# EasyEDA Pro project 304-Quad-Channel-Voltage-Controlled-Mixer.eprj

# Board PCB1
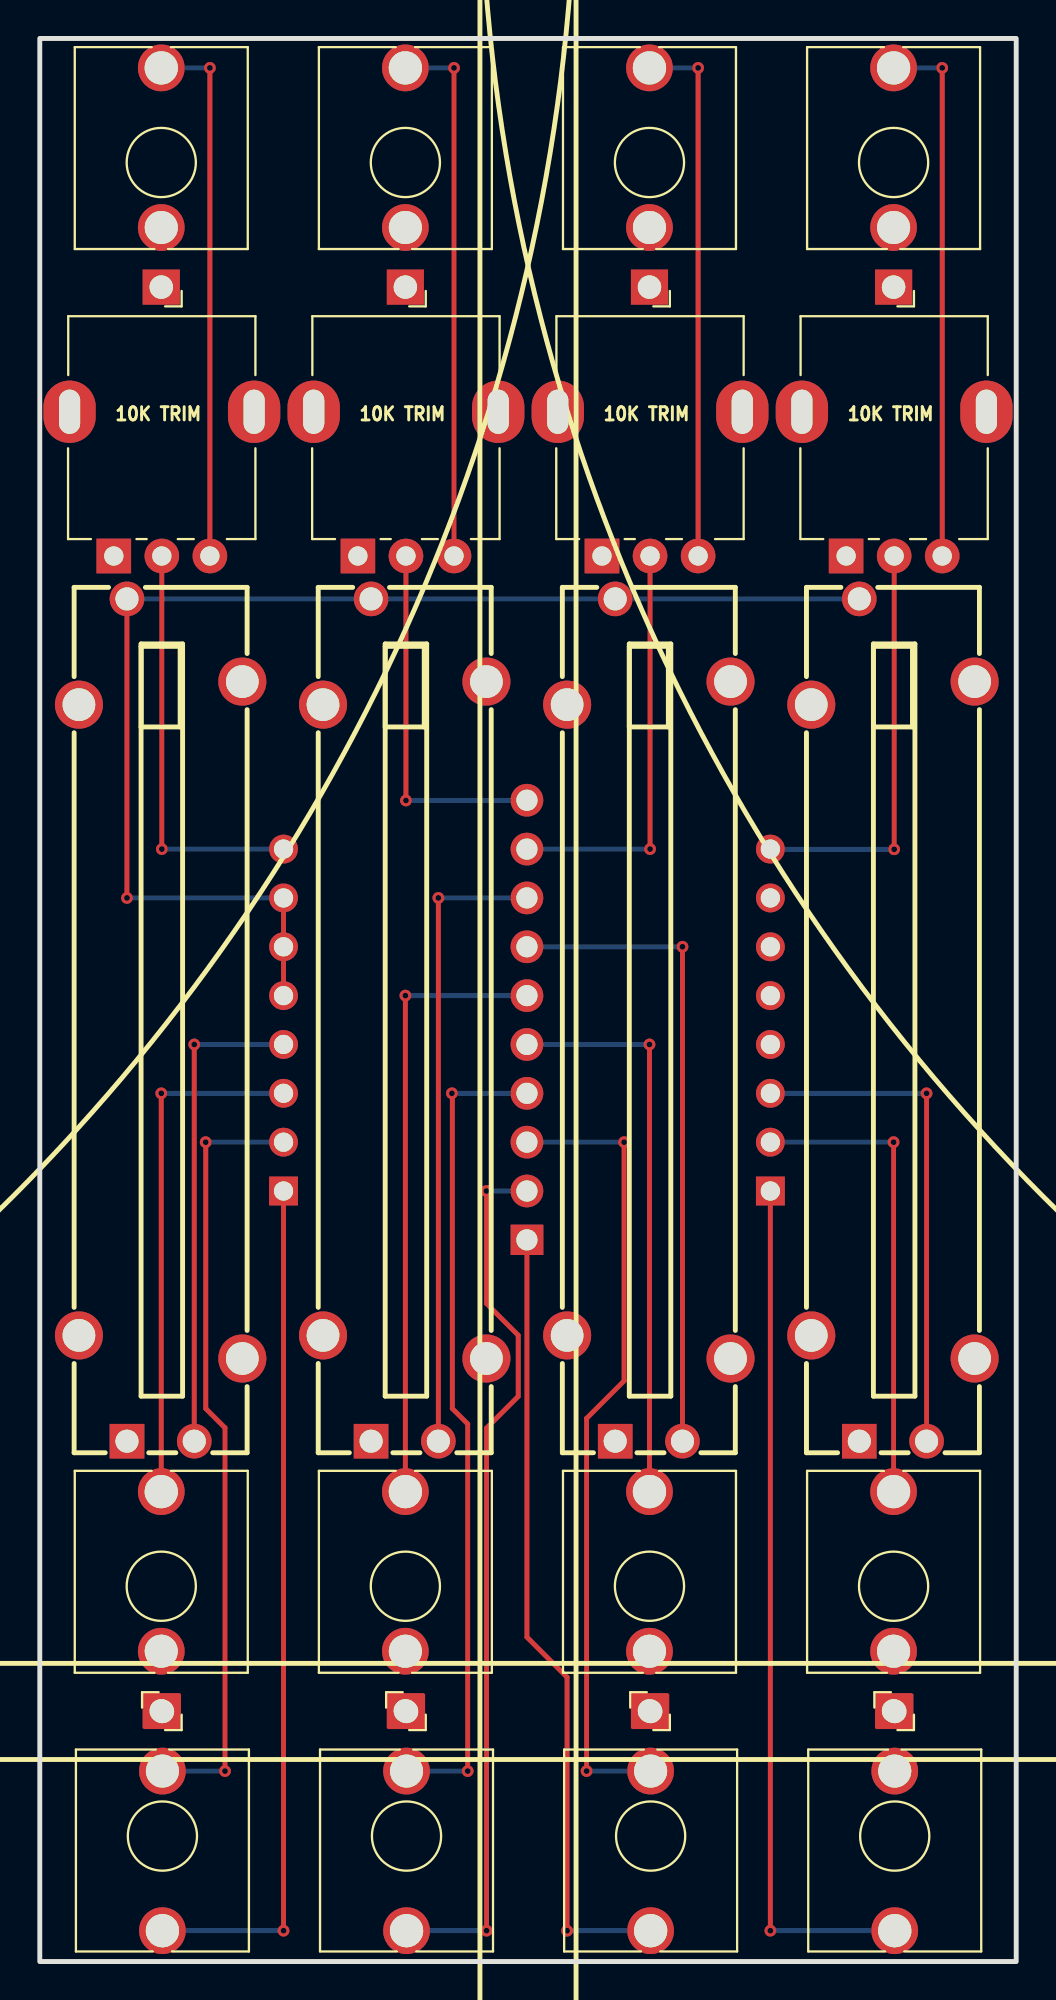
[diagram p0: board, top side]
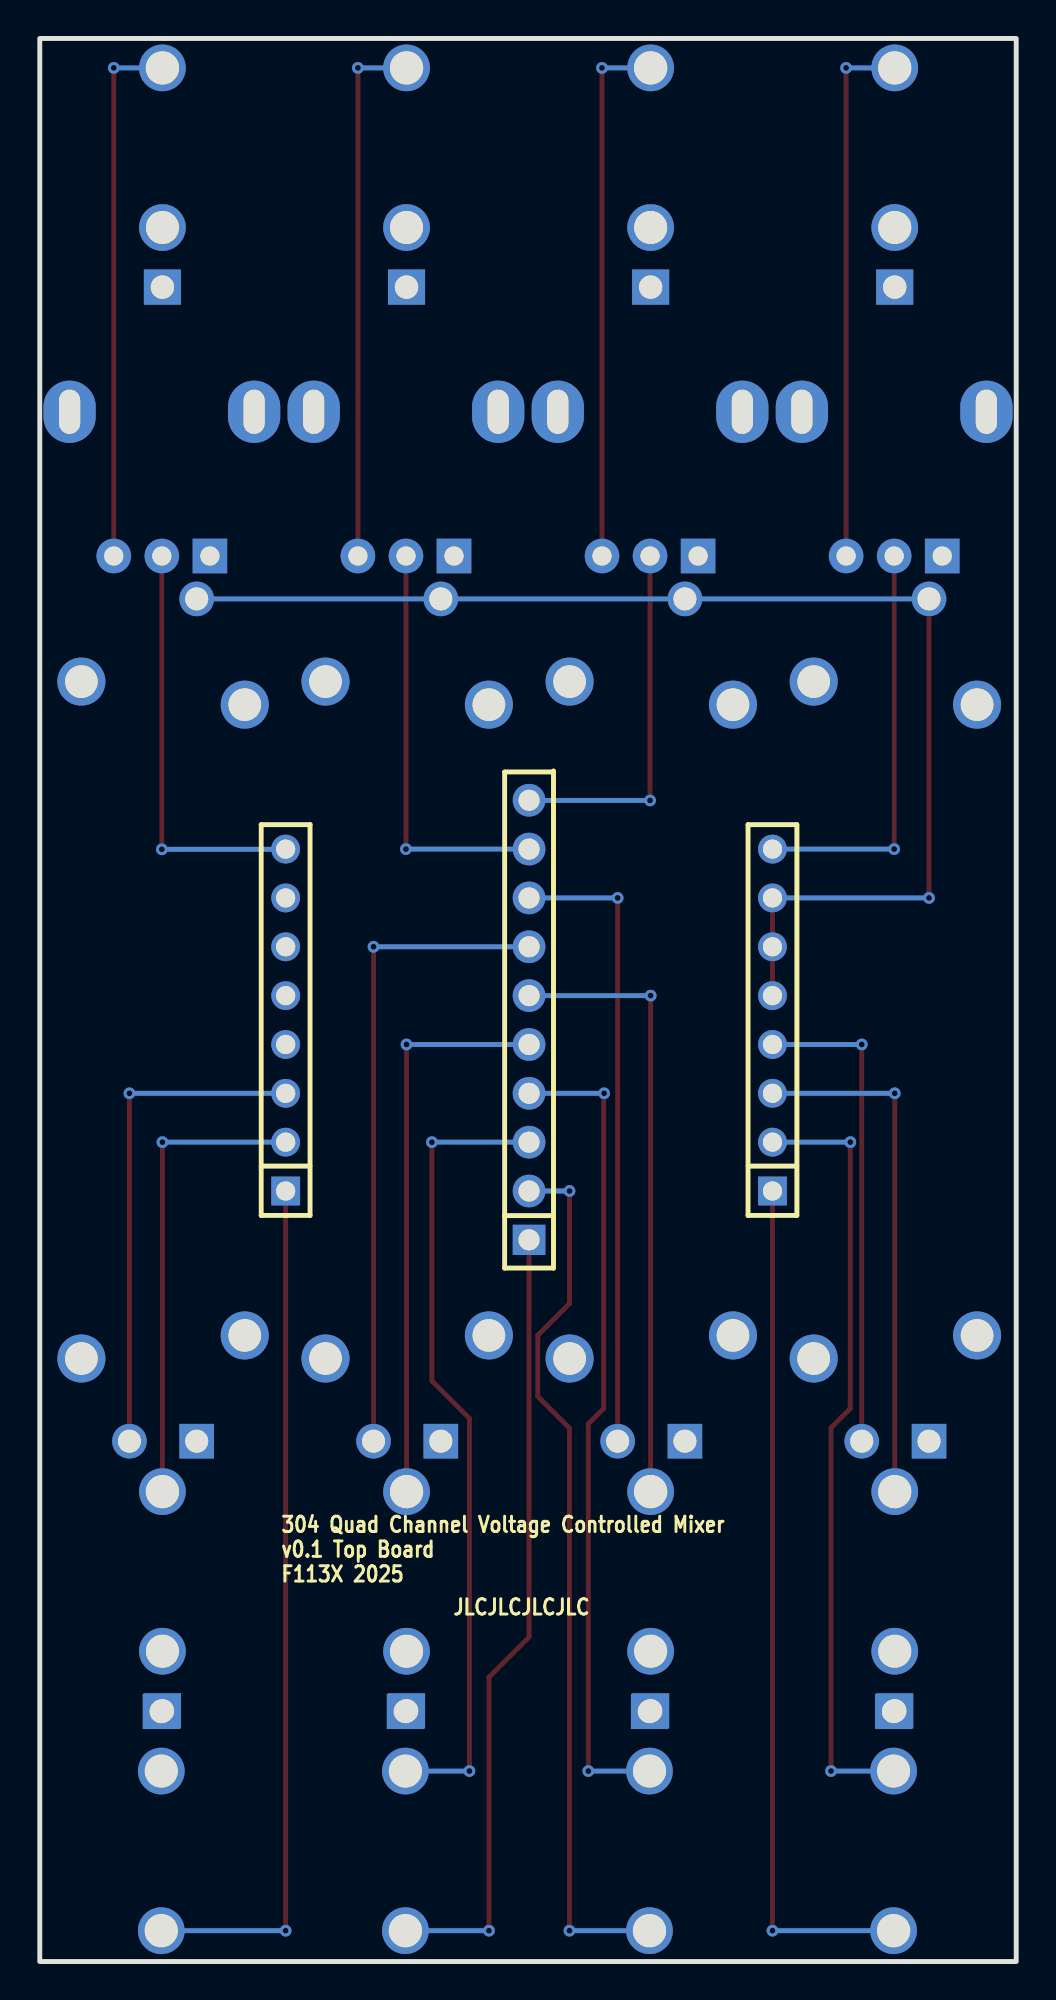
[diagram p1: board, bottom side, seen from below]

Outline 50.8 x 100 mm; copper layers: Top Layer, Bottom Layer. Coordinates in mm from the lower left corner of the outline.
Outline path: rectangle 0,100 50.8,0
Stack: Top Layer 0.035mm / Dielectric1 1.51mm FR4 er 4.5 / Bottom Layer 0.035mm

## Design rules (mm)
template: JLCPCB Capability(Two Layers Board)
spacing copperThickness1oz (default): track to track 0.102, other pairs 0.152 to 0.3
spacing copperThickness2oz: track to track 0.203, other pairs 0.152 to 0.3
track width copperThickness1oz (default): min 0.127, default 0.254, max 2.54
track width copperThickness2oz: min 0.203, default 0.254, max 2.54
differential pair differentialPair (default): width min 0.127, default 0.254, max 2.54; gap min 0.152, default 0.152
via viaSize (default): diameter min 0.5, default 0.61, max 10; hole min 0.3, default 0.305, max 6.3

## Placement (name value [footprint] x y rotation side)
10K TRIM  -  [benjiaomodular:Potentiometer_RV09]  3.85 73.09 90 top
10K TRIM#2  -  [benjiaomodular:Potentiometer_RV09]  16.55 73.09 90 top
10K TRIM#3  -  [benjiaomodular:Potentiometer_RV09]  29.25 73.09 90 top
10K TRIM#4  -  [benjiaomodular:Potentiometer_RV09]  41.95 73.09 90 top
H1  -  [HDR-TH_8P-P2.54-V-M]  12.68 48.96 90 bottom
H1#2  -  [HDR-TH_8P-P2.54-V-M]  38.01 48.96 90 bottom
H2  PZ254V-11-10P  [HDR-TH_10P-P2.54-V-M]  25.34 48.96 90 bottom
J1  -  [benjiaomodular:AudioJack_3.5mm]  6.32 13.04 180 top
J1#2  -  [benjiaomodular:AudioJack_3.5mm]  6.38 13 0 top
J1#3  -  [benjiaomodular:AudioJack_3.5mm]  6.32 87.07 180 top
J1#4  -  [benjiaomodular:AudioJack_3.5mm]  19.02 87.07 180 top
J1#5  -  [benjiaomodular:AudioJack_3.5mm]  31.72 87.07 180 top
J1#6  -  [benjiaomodular:AudioJack_3.5mm]  44.42 87.07 180 top
J1#7  -  [benjiaomodular:AudioJack_3.5mm]  31.78 13 0 top
J1#8  -  [benjiaomodular:AudioJack_3.5mm]  31.72 13.04 180 top
J1#9  -  [benjiaomodular:AudioJack_3.5mm]  44.48 13 0 top
J1#10  -  [benjiaomodular:AudioJack_3.5mm]  44.42 13.04 180 top
J1#11  -  [benjiaomodular:AudioJack_3.5mm]  19.02 13.04 180 top
J1#12  -  [benjiaomodular:AudioJack_3.5mm]  19.08 13 0 top
R1  -  [RES-ADJ-TH_L45.0-W9.0_C3051N-CE20B5.0-A103-0P0]  6.29 48.96 90 top
R1#2  -  [RES-ADJ-TH_L45.0-W9.0_C3051N-CE20B5.0-A103-0P0]  18.99 48.96 90 top
R1#3  -  [RES-ADJ-TH_L45.0-W9.0_C3051N-CE20B5.0-A103-0P0]  31.69 48.96 90 top
R1#4  -  [RES-ADJ-TH_L45.0-W9.0_C3051N-CE20B5.0-A103-0P0]  44.39 48.96 90 top

## Footprints (pads in the part's own frame, mm; a bottom-side part is the same pattern mirrored in y, then rotated)
benjiaomodular:AudioJack_3.5mm
  rect 1.93x1.83 hole 1.22: S(0,0)
  round 2.43 hole 1.73: T(0,-11.4)
  round 2.43 hole 1.72: TN(0,-3.1)
benjiaomodular:Potentiometer_RV09
  rect 1.8x1.8 hole 1: 1(0,0)
  round 1.8 hole 1: 2(0,-2.5) 3(0,-5)
  oval 3.24x2.72 hole 2.3x1.1: 4(7.5,-7.3) 5(7.5,2.3)
HDR-TH_8P-P2.54-V-M
  rect 1.5x1.5 hole 1: 1(-8.89,0)
  round 1.5 hole 1: 2(-6.35,0) 3(-3.81,0) 4(-1.27,0) 5(1.27,0) 6(3.81,0) 7(6.35,0) 8(8.89,0)
HDR-TH_10P-P2.54-V-M
  rect 1.575x1.7 hole 1.1: 1(-11.43,0)
  round 1.7 hole 1.1: 2(-8.89,0) 3(-6.35,0) 4(-3.81,0) 5(-1.27,0) 6(1.27,0) 7(3.81,0) 8(6.35,0) 9(8.89,0) 10(11.43,0)
RES-ADJ-TH_L45.0-W9.0_C3051N-CE20B5.0-A103-0P0
  rect 1.8x1.8 hole 1.2: 1(-21.9,1.75)
  round 1.8 hole 1.2: 2(-21.9,-1.75) 3(21.9,1.75)
  round 2.5 hole 1.7: 4(-16.4,4.25) 5(16.4,4.25) 6(17.6,-4.25) 7(-17.6,-4.25)

## Nets
GND: 10K TRIM.1 10K TRIM#2.1 10K TRIM#3.1 10K TRIM#4.1 H1#2.4 H1#2.5 H1#2.6 H1#2.7 J1.S J1#2.S J1#3.S J1#4.S J1#5.S J1#6.S J1#7.S J1#8.S J1#9.S J1#10.S J1#11.S J1#12.S R1.1 R1#2.1 R1#3.1 R1#4.1
+12: H1.5 H1.6 H1.7 R1.3 R1#2.3 R1#3.3 R1#4.3
CH1-CV: 10K TRIM.2 H1.8
CH1-IN: H1.3 J1.T
CH1-MIX: H1.2 J1#2.TN
CH1-OUT: H1.1 J1#2.T
CH2-CV: 10K TRIM#2.2 H2.10
CH2-IN: H2.6 J1#11.T
CH2-MIX: H2.4 J1#12.TN
CH2-OUT: H2.2 J1#12.T
CH3-CV: 10K TRIM#3.2 H2.9
CH3-IN: H2.5 J1#8.T
CH3-MIX: H2.3 J1#7.TN
CH3-OUT: H2.1 J1#7.T
CH4-CV: 10K TRIM#4.2 H1#2.8
CH4-IN: H1#2.2 J1#10.T
CH4/MIX-OUT: H1#2.1 J1#9.T
CHAN1-CV: 10K TRIM.3 J1#3.T
CHAN1-OFFSET: H1.4 R1.2
CHAN2-CV: 10K TRIM#2.3 J1#4.T
CHAN2-OFFSET: H2.8 R1#2.2
CHAN3-CV: 10K TRIM#3.3 J1#5.T
CHAN3-OFFSET: H2.7 R1#3.2
CHAN4-CV: 10K TRIM#4.3 J1#6.T
CHAN4-OFFSET: H1#2.3 R1#4.2

Pads without a net: 10K TRIM 4 5; 10K TRIM#2 4 5; 10K TRIM#3 4 5; 10K TRIM#4 4 5; J1 TN; J1#3 TN; J1#4 TN; J1#5 TN; J1#6 TN; J1#8 TN; J1#9 TN; J1#10 TN; J1#11 TN; R1 4 5 6 7; R1#2 4 5 6 7; R1#3 4 5 6 7; R1#4 4 5 6 7

## Via types
v1: diameter 0.61, hole 0.305, Top Layer to Bottom Layer, 28 vias

## Routing (per net, layer and track width the routed paths; a pad name or vN(x,y) marks a point on that pad's centre or on a via; arc(x,y) is an arc through that point)
+12: length 66.9
  Top Layer w0.254: H1.7 H1.6 H1.5 ; v1(4.54,55.31) R1.3
  Bottom Layer w0.254: v1(4.54,55.31) H1.7 ; R1.3 R1#2.3 R1#3.3 R1#4.3
CH1-CV: length 21.6
  Top Layer w0.254: v1(6.35,57.85) 10K TRIM.2
  Bottom Layer w0.254: v1(6.35,57.85) H1.8
CH1-IN: length 27.1
  Top Layer w0.254: J1.T v1(6.32,45.15)
  Bottom Layer w0.254: H1.3 v1(6.32,45.15)
CH1-MIX: length 40.4
  Top Layer w0.254: v1(8.63,42.61) 8.64,42.6 8.64,28.75 9.64,27.75 v1(9.64,9.9)
  Bottom Layer w0.254: H1.2 v1(8.63,42.61) ; J1#2.TN v1(9.64,9.9)
CH1-OUT: length 44.8
  Top Layer w0.254: v1(12.68,1.6) H1.1
  Bottom Layer w0.254: J1#2.T v1(12.68,1.6)
CH2-CV: length 19
  Top Layer w0.254: v1(19.05,60.38) 10K TRIM#2.2
  Bottom Layer w0.254: v1(19.05,60.38) 25.33,60.38 H2.10
CH2-IN: length 32.1
  Top Layer w0.254: J1#11.T v1(19.02,50.23)
  Bottom Layer w0.254: v1(19.02,50.23) H2.6
CH2-MIX: length 42.7
  Top Layer w0.254: v1(21.44,45.15) 21.46,45.12 21.46,28.75 22.26,27.95 v1(22.26,9.9)
  Bottom Layer w0.254: v1(21.44,45.15) H2.4 ; J1#12.TN v1(22.26,9.9)
CH2-OUT: length 46.1
  Top Layer w0.254: v1(23.24,1.6) 23.24,27.74 24.89,29.39 24.89,32.56 23.24,34.21 v1(23.24,40.07)
  Bottom Layer w0.254: J1#12.T v1(23.24,1.6) ; v1(23.24,40.07) H2.2
CH3-CV: length 21.6
  Top Layer w0.254: v1(31.75,57.85) 10K TRIM#3.2
  Bottom Layer w0.254: v1(31.75,57.85) H2.9
CH3-IN: length 29.6
  Top Layer w0.254: v1(31.72,47.69) J1#8.T
  Bottom Layer w0.254: H2.5 v1(31.72,47.69)
CH3-MIX: length 41.9
  Top Layer w0.254: v1(30.4,42.61) 30.4,30.2 28.45,28.25 v1(28.45,9.9)
  Bottom Layer w0.254: v1(28.45,9.9) J1#7.TN ; H2.3 v1(30.4,42.61)
CH3-OUT: length 41.1
  Top Layer w0.254: v1(27.43,1.6) 27.43,14.78 25.34,16.87 H2.1
  Bottom Layer w0.254: v1(27.43,1.6) J1#7.T
CH4-CV: length 21.7
  Top Layer w0.254: v1(44.45,57.84) 10K TRIM#4.2
  Bottom Layer w0.254: v1(44.45,57.84) 38.02,57.84 H1#2.8
CH4-IN: length 24.6
  Top Layer w0.254: J1#10.T v1(44.42,42.61)
  Bottom Layer w0.254: H1#2.2 v1(44.42,42.61)
CH4/MIX-OUT: length 44.9
  Top Layer w0.254: v1(38.01,1.6) H1#2.1
  Bottom Layer w0.254: v1(38.01,1.6) J1#9.T
CHAN1-CV: length 27.9
  Top Layer w0.254: v1(8.85,98.47) 10K TRIM.3
  Bottom Layer w0.254: J1#3.T v1(8.85,98.47)
CHAN1-OFFSET: length 25.3
  Top Layer w0.254: R1.2 v1(8.04,47.69)
  Bottom Layer w0.254: v1(8.04,47.69) H1.4
CHAN2-CV: length 27.9
  Top Layer w0.254: v1(21.55,98.47) 10K TRIM#2.3
  Bottom Layer w0.254: J1#4.T v1(21.55,98.47)
CHAN2-OFFSET: length 32.9
  Top Layer w0.254: v1(20.74,55.31) R1#2.2
  Bottom Layer w0.254: H2.8 v1(20.74,55.31)
CHAN3-CV: length 27.9
  Top Layer w0.254: v1(34.25,98.47) 10K TRIM#3.3
  Bottom Layer w0.254: J1#5.T v1(34.25,98.47)
CHAN3-OFFSET: length 33.8
  Top Layer w0.254: v1(33.44,52.77) R1#3.2
  Bottom Layer w0.254: v1(33.44,52.77) H2.7
CHAN4-CV: length 27.9
  Top Layer w0.254: v1(46.95,98.47) 10K TRIM#4.3
  Bottom Layer w0.254: v1(46.95,98.47) J1#6.T
CHAN4-OFFSET: length 26.2
  Top Layer w0.254: v1(46.14,45.15) R1#4.2
  Bottom Layer w0.254: v1(46.14,45.15) H1#2.3

## Copper pours and planes (outline as drawn; the poured copper is in the pictures)
GND on Top Layer: 0,100 50.8,100 50.8,0 0,0
GND on Bottom Layer: 0,100 50.8,100 50.8,0 0,0

## Text on the board
Bottom Silkscreen Layer: JLCJLCJLCJLC | 304 Quad Channel Voltage Controlled Mixer / v0.1 Top Board / F113X 2025

# Board PCB2
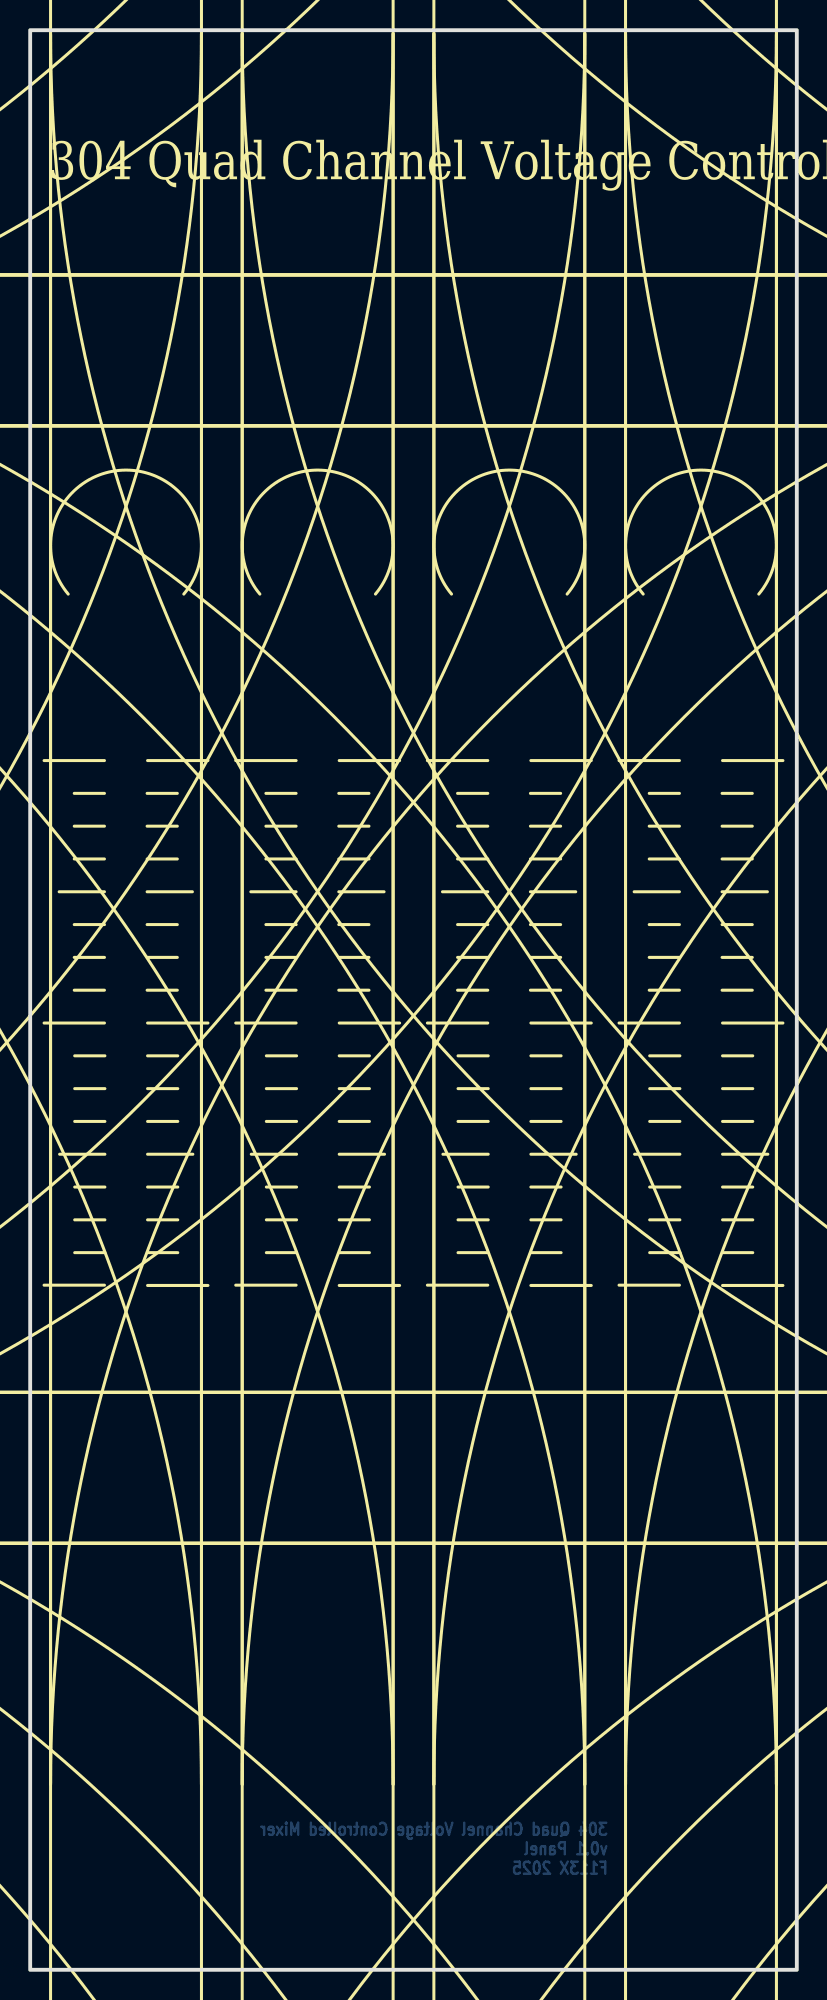
[diagram p2: board, top side]
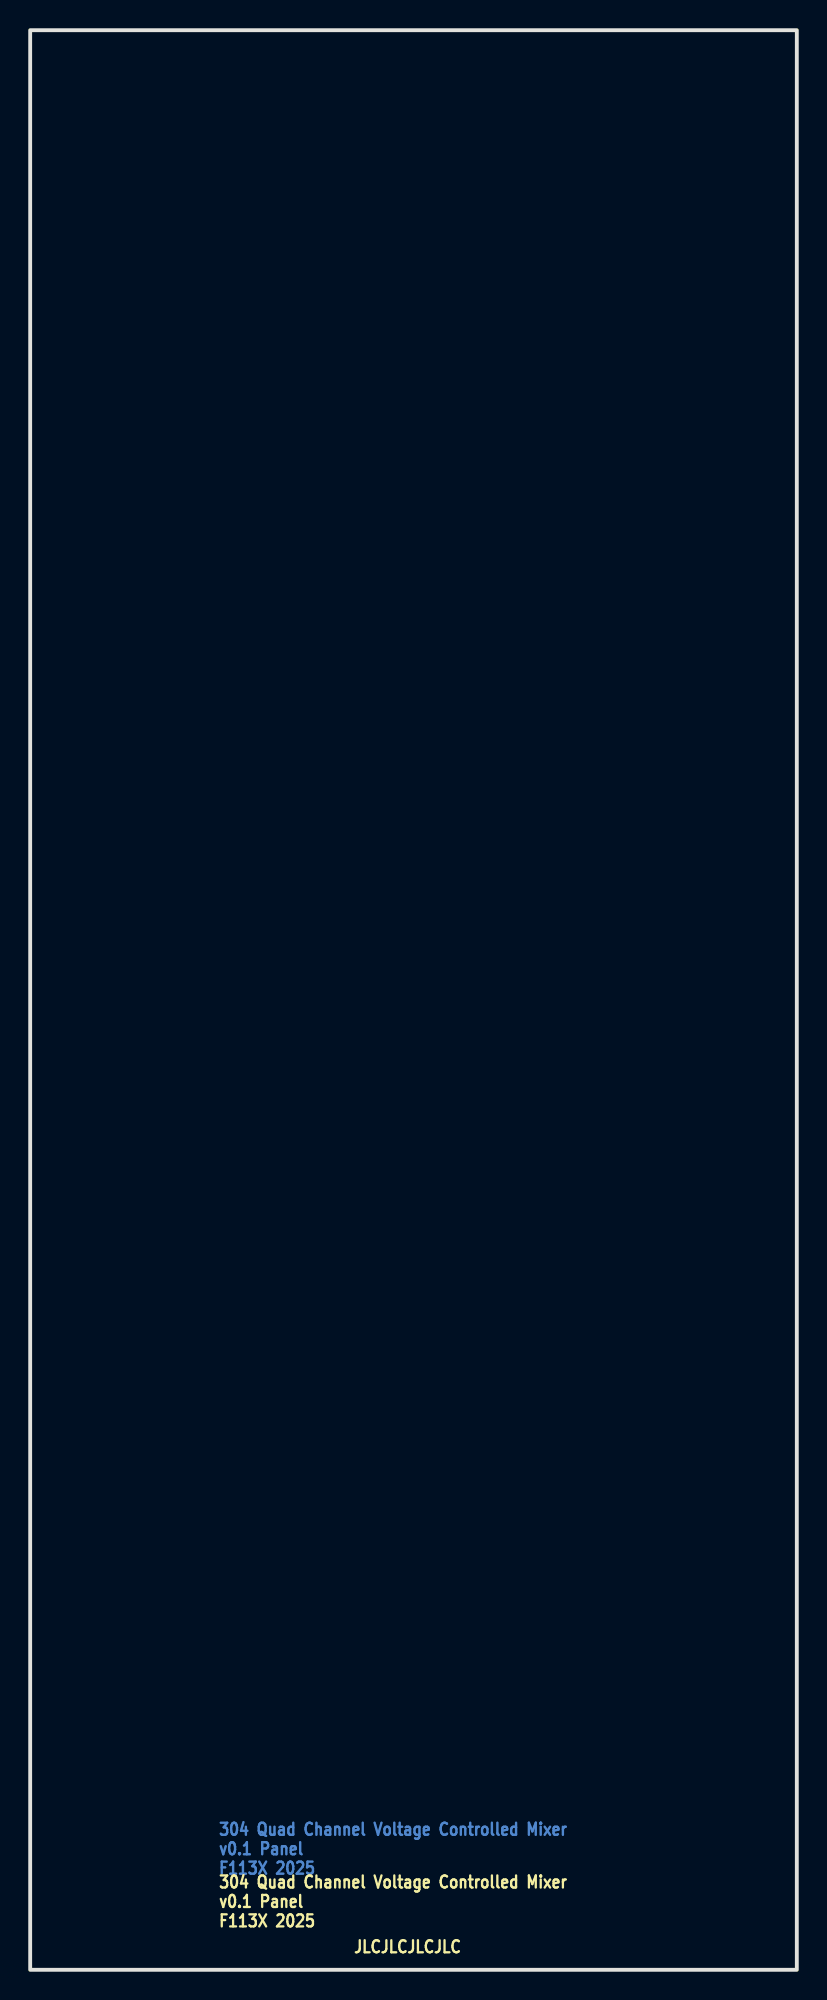
[diagram p3: board, bottom side, seen from below]

Outline 50.8 x 128.5 mm; copper layers: Top Layer, Bottom Layer. Coordinates in mm from the lower left corner of the outline.
Outline path: rectangle 0,128.5 50.8,0
Stack: Top Layer 0.035mm / Dielectric1 1.51mm FR4 er 4.5 / Bottom Layer 0.035mm

## Design rules (mm)
template: JLCPCB Capability(Two Layers Board)
spacing copperThickness1oz (default): track to track 0.102, other pairs 0.152 to 0.3
spacing copperThickness2oz: track to track 0.203, other pairs 0.152 to 0.3
track width copperThickness1oz (default): min 0.127, default 0.254, max 2.54
track width copperThickness2oz: min 0.203, default 0.254, max 2.54
differential pair differentialPair (default): width min 0.127, default 0.254, max 2.54; gap min 0.152, default 0.152
via viaSize (default): diameter min 0.5, default 0.61, max 10; hole min 0.3, default 0.305, max 6.3

## Placement (name value [footprint] x y rotation side)

## Nets

## Text on the board
Bottom Layer: 304 Quad Channel Voltage Controlled Mixer / v0.1 Panel / F113X 2025
Bottom Silkscreen Layer: JLCJLCJLCJLC | 304 Quad Channel Voltage Controlled Mixer / v0.1 Panel / F113X 2025
Top Silkscreen Layer: 304 Quad Channel Voltage Controlled Mixer

# Board PCB3
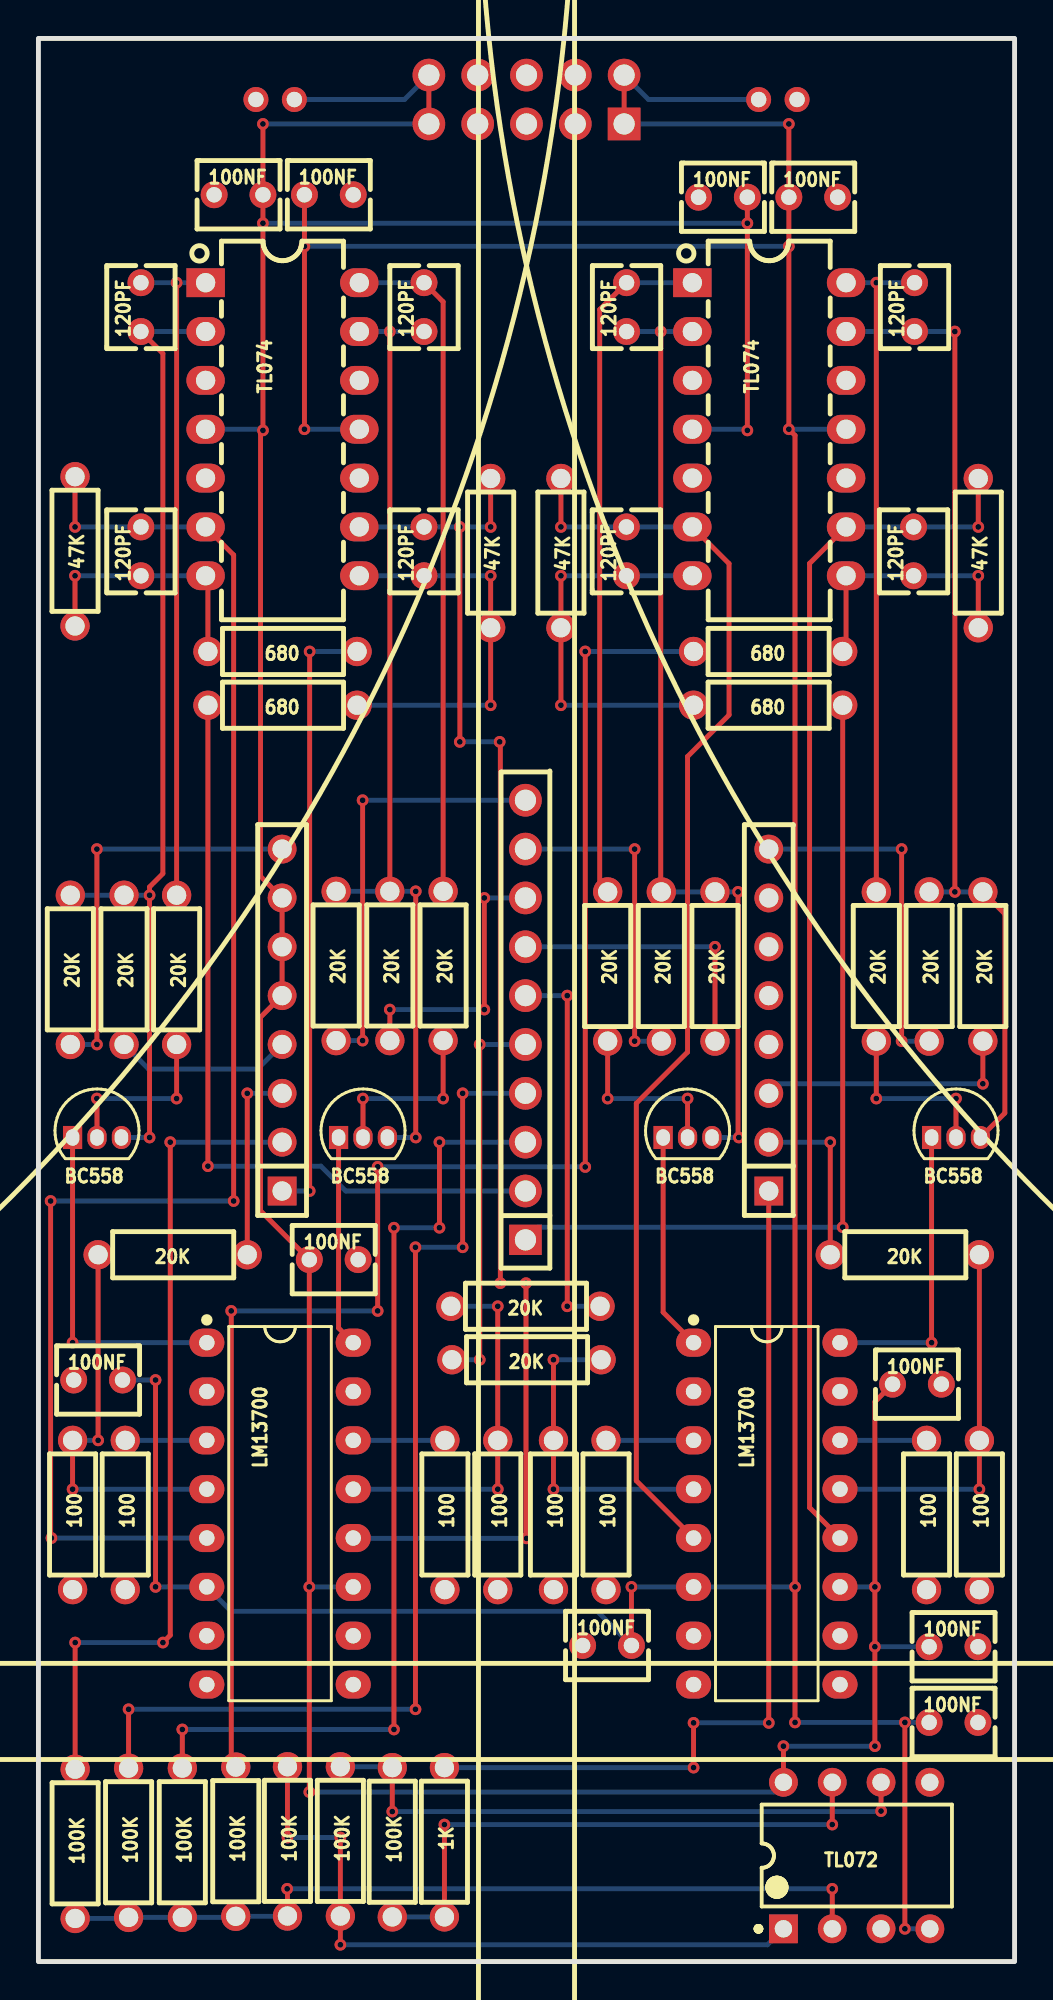
[diagram p4: board, top side]
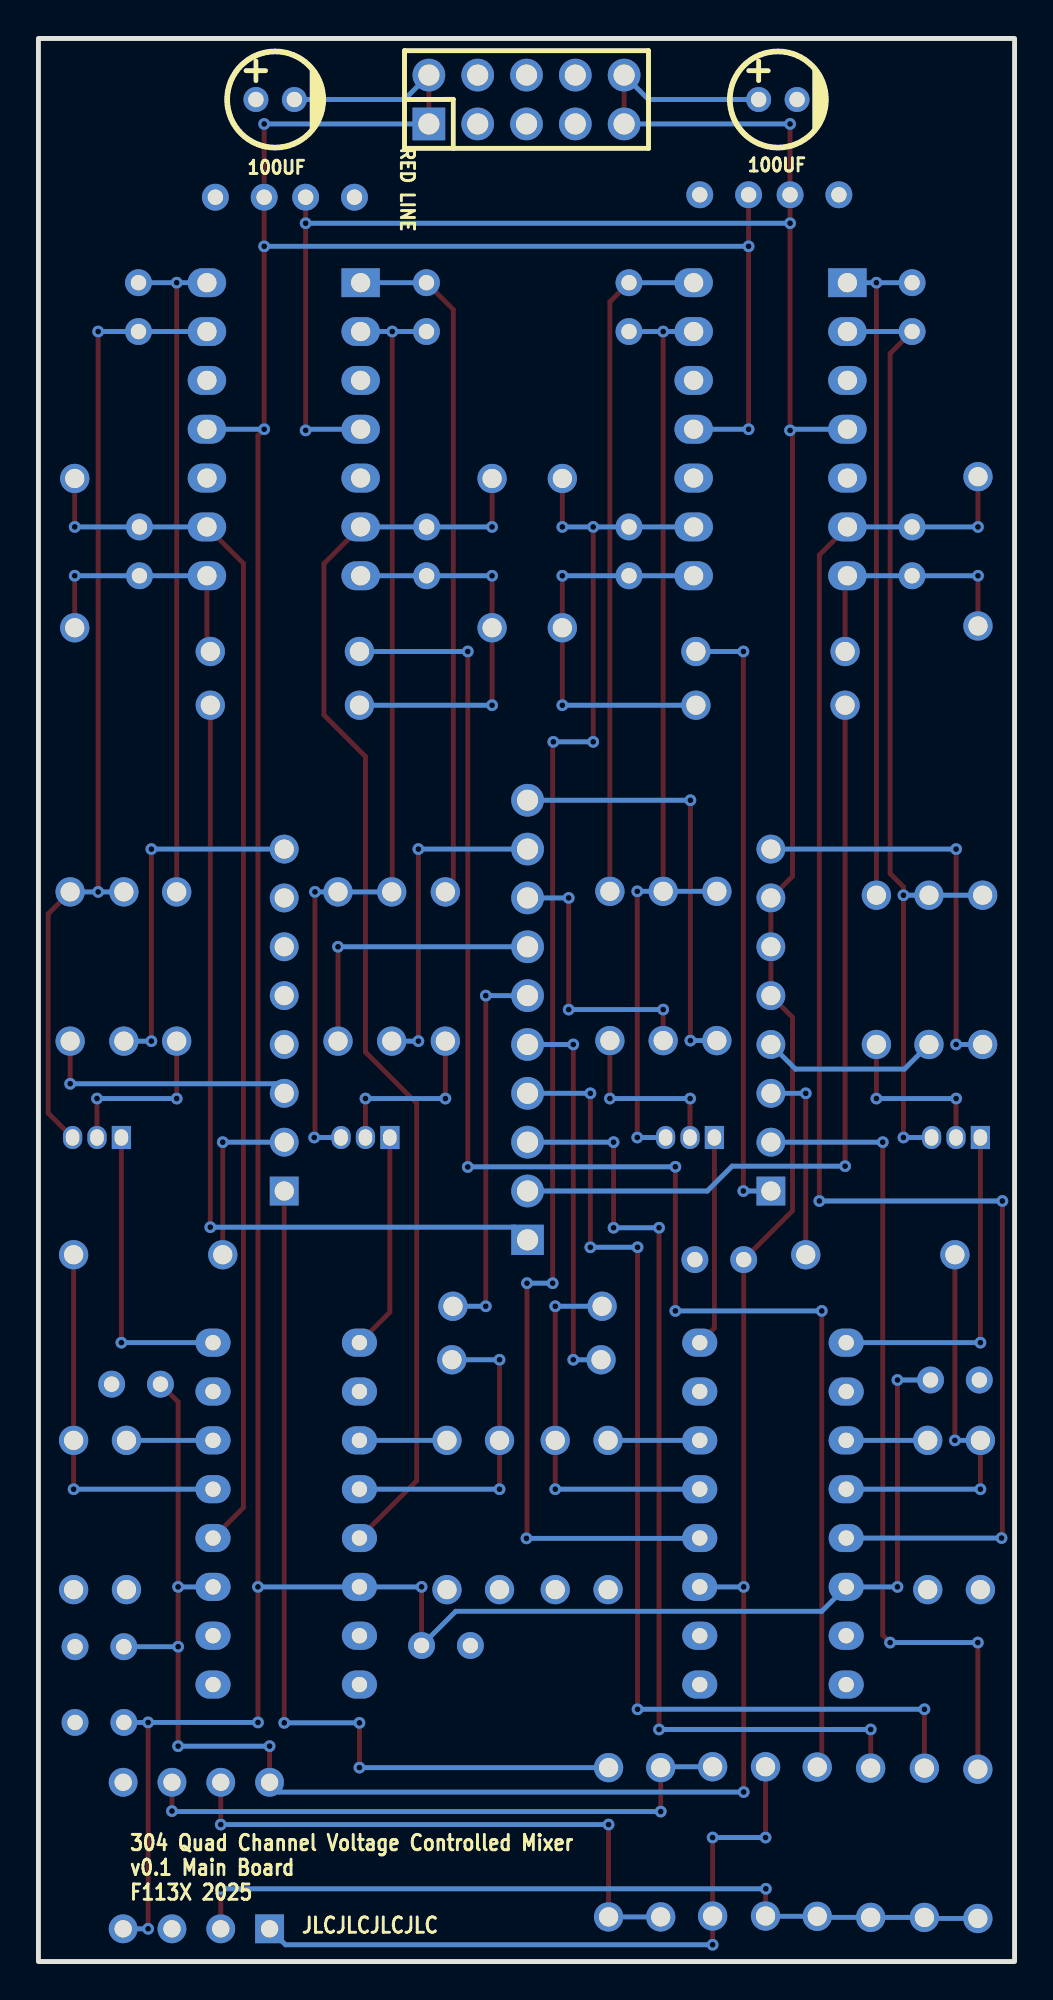
[diagram p5: board, bottom side, seen from below]

Outline 50.8 x 100 mm; copper layers: Top Layer, Bottom Layer. Coordinates in mm from the lower left corner of the outline.
Outline path: rectangle 0,100 50.8,0
Stack: Top Layer 0.035mm / Dielectric1 1.51mm FR4 er 4.5 / Bottom Layer 0.035mm

## Design rules (mm)
template: JLCPCB Capability(Two Layers Board)
spacing copperThickness1oz (default): track to track 0.102, other pairs 0.152 to 0.3
spacing copperThickness2oz: track to track 0.203, other pairs 0.152 to 0.3
track width copperThickness1oz (default): min 0.127, default 0.254, max 2.54
track width copperThickness2oz: min 0.203, default 0.254, max 2.54
differential pair differentialPair (default): width min 0.127, default 0.254, max 2.54; gap min 0.152, default 0.152
via viaSize (default): diameter min 0.5, default 0.61, max 10; hole min 0.3, default 0.305, max 6.3

## Placement (name value [footprint] x y rotation side)
1K  -  [Resistor_Small]  21.13 6.2 90 top
20K  -  [Resistor_Small]  6.98 36.75 0 top
20K#2  -  [Resistor_Small]  25.34 34.07 0 top
20K#3  -  [Resistor_Small]  25.4 31.29 0 top
20K#4  -  [Resistor_Small]  45.09 36.75 0 top
20K#5  -  [Resistor_Small]  4.45 51.57 90 top
20K#6  -  [Resistor_Small]  1.66 51.57 90 top
20K#7  -  [Resistor_Small]  49.15 51.74 90 top
20K#8  -  [Resistor_Small]  46.35 51.74 90 top
20K#9  -  [Resistor_Small]  35.21 51.74 90 top
20K#10  -  [Resistor_Small]  32.41 51.74 90 top
20K#11  -  [Resistor_Small]  18.29 51.77 90 top
20K#12  -  [Resistor_Small]  15.49 51.77 90 top
20K#13  -  [Resistor_Small]  7.19 51.57 90 top
20K#14  -  [Resistor_Small]  21.06 51.77 90 top
20K#15  -  [Resistor_Small]  29.62 51.74 90 top
20K#16  -  [Resistor_Small]  43.6 51.74 90 top
47K  -  [Resistor_Small]  1.9 73.33 90 top
47K#2  -  [Resistor_Small]  23.53 73.24 90 top
47K#3  -  [Resistor_Small]  27.19 73.24 90 top
47K#4  -  [Resistor_Small]  48.91 73.24 90 top
100  -  [Resistor_Small]  21.15 23.22 90 top
100#2  -  [Resistor_Small]  1.78 23.22 90 top
100#3  -  [Resistor_Small]  26.8 23.22 90 top
100#4  -  [Resistor_Small]  23.9 23.22 90 top
100#5  -  [Resistor_Small]  48.97 23.22 90 top
100#6  -  [Resistor_Small]  4.52 23.22 90 top
100#7  -  [Resistor_Small]  29.54 23.22 90 top
100#8  -  [Resistor_Small]  46.22 23.22 90 top
100K  -  [Resistor_Small]  7.49 6.18 90 top
100K#2  -  [Resistor_Small]  4.69 6.17 90 top
100K#3  -  [Resistor_Small]  1.91 6.12 90 top
100K#4  -  [Resistor_Small]  12.96 6.25 90 top
100K#5  -  [Resistor_Small]  15.71 6.25 90 top
100K#6  -  [Resistor_Small]  18.41 6.2 90 top
100K#7  -  [Resistor_Small]  10.27 6.23 90 top
100NF  -  [CAP-TH_L4.2-W3.5-P2.54-D0.5]  40.32 91.75 0 top
100NF#2  -  [CAP-TH_L4.2-W3.5-P2.54-D0.5]  10.41 91.87 0 top
100NF#3  -  [CAP-TH_L4.2-W3.5-P2.54-D0.5]  15.11 91.87 0 top
100NF#4  -  [CAP-TH_L4.2-W3.5-P2.54-D0.5]  35.62 91.75 0 top
100NF#5  -  [CAP-TH_L4.2-W3.5-P2.54-D0.5]  47.62 16.37 0 top
100NF#6  -  [CAP-TH_L4.2-W3.5-P2.54-D0.5]  47.62 12.43 0 top
100NF#7  -  [CAP-TH_L4.2-W3.5-P2.54-D0.5]  45.72 30.02 0 top
100NF#8  -  [CAP-TH_L4.2-W3.5-P2.54-D0.5]  29.59 16.43 0 top
100NF#9  -  [CAP-TH_L4.2-W3.5-P2.54-D0.5]  3.11 30.24 0 top
100NF#10  -  [CAP-TH_L4.2-W3.5-P2.54-D0.5]  15.37 36.5 0 top
100UF  -  [CAP-TH_BD5.0-P2.00-D0.8-FD]  12.32 96.83 180 bottom
100UF#2  -  [CAP-TH_BD5.0-P2.00-D0.8-FD]  38.48 96.83 180 bottom
120PF  -  [CAP-TH_L4.2-W3.5-P2.54-D0.5]  5.33 86.03 90 top
120PF#2  -  [CAP-TH_L4.2-W3.5-P2.54-D0.5]  20.07 86.03 90 top
120PF#3  -  [CAP-TH_L4.2-W3.5-P2.54-D0.5]  30.61 86.03 90 top
120PF#4  -  [CAP-TH_L4.2-W3.5-P2.54-D0.5]  45.59 86.03 90 top
120PF#5  -  [CAP-TH_L4.2-W3.5-P2.54-D0.5]  5.33 73.33 90 top
120PF#6  -  [CAP-TH_L4.2-W3.5-P2.54-D0.5]  20.07 73.33 90 top
120PF#7  -  [CAP-TH_L4.2-W3.5-P2.54-D0.5]  30.6 73.33 90 top
120PF#8  -  [CAP-TH_L4.2-W3.5-P2.54-D0.5]  45.54 73.33 90 top
680  -  [Resistor_Small]  12.7 68.12 0 top
680#2  -  [Resistor_Small]  12.7 65.33 0 top
680#3  -  [Resistor_Small]  37.97 65.33 0 top
680#4  -  [Resistor_Small]  37.97 68.12 0 top
BC558  -  [TO-92-3_L4.5-W3.5-P1.27-L]  3.05 42.85 0 top
BC558#2  -  [TO-92-3_L4.5-W3.5-P1.27-L]  16.89 42.85 0 top
BC558#3  -  [TO-92-3_L4.5-W3.5-P1.27-L]  33.78 42.85 0 top
BC558#4  -  [TO-92-3_L4.5-W3.5-P1.27-L]  47.75 42.85 0 top
H1  -  [HDR-TH_8P-P2.54-V-M]  38.01 48.96 90 top
H1#2  -  [HDR-TH_8P-P2.54-V-M]  12.68 48.96 90 top
H2  PZ254V-11-10P  [HDR-TH_10P-P2.54-V-M]  25.34 48.96 90 top
LM13700  -  [DIP-16_L19.3-W6.4-P2.54-LS7.6-BL]  12.57 23.29 270 top
LM13700#2  -  [DIP-16_L19.3-W6.4-P2.54-LS7.6-BL]  37.9 23.29 270 top
RED LINE  ZX-PZ2.54-2-5PZZ  [HDR-TH_10P-P2.54-V-M-R2-C5-S2.54]  25.4 96.83 180 bottom
TL072  NE555N  [DIP-8_L9.8-W6.6-P2.54-LS7.6-BL]  42.58 5.51 0 top
TL074  -  [PDIP-14_L19.7-W6.6-P2.54-LS8.3-BL]  12.7 79.68 270 top
TL074#2  -  [PDIP-14_L19.7-W6.6-P2.54-LS8.3-BL]  38.03 79.68 270 top

## Footprints (pads in the part's own frame, mm; a bottom-side part is the same pattern mirrored in y, then rotated)
CAP-TH_BD5.0-P2.00-D0.8-FD
  round 1.3 hole 0.8: 1(-1,0) 2(1,0)
CAP-TH_L4.2-W3.5-P2.54-D0.5
  round 1.4 hole 0.8: 1(-1.27,0) 2(1.27,0)
DIP-8_L9.8-W6.6-P2.54-LS7.6-BL
  rect 1.5x1.5 hole 0.9: 1(-3.81,-3.81)
  round 1.5 hole 0.9: 2(-1.27,-3.81) 3(1.27,-3.81) 4(3.81,-3.81) 5(3.81,3.81) 6(1.27,3.81) 7(-1.27,3.81) 8(-3.81,3.81)
DIP-16_L19.3-W6.4-P2.54-LS7.6-BL
  oval 1.46x1.825 hole 0.8: 1(-8.89,-3.81) 2(-6.35,-3.81) 3(-3.81,-3.81) 4(-1.27,-3.81) 5(1.27,-3.81) 6(3.81,-3.81) 7(6.35,-3.81) 8(8.89,-3.81) 9(8.89,3.81) 10(6.35,3.81) 11(3.81,3.81) 12(1.27,3.81) 13(-1.27,3.81) 14(-3.81,3.81) 15(-6.35,3.81) 16(-8.89,3.81)
HDR-TH_8P-P2.54-V-M
  rect 1.5x1.5 hole 1: 1(-8.89,0)
  round 1.5 hole 1: 2(-6.35,0) 3(-3.81,0) 4(-1.27,0) 5(1.27,0) 6(3.81,0) 7(6.35,0) 8(8.89,0)
HDR-TH_10P-P2.54-V-M
  rect 1.575x1.7 hole 1.1: 1(-11.43,0)
  round 1.7 hole 1.1: 2(-8.89,0) 3(-6.35,0) 4(-3.81,0) 5(-1.27,0) 6(1.27,0) 7(3.81,0) 8(6.35,0) 9(8.89,0) 10(11.43,0)
HDR-TH_10P-P2.54-V-M-R2-C5-S2.54
  rect 1.7x1.7 hole 1.1: 1(-5.08,-1.27)
  round 1.7 hole 1.1: 2(-5.08,1.27) 3(-2.54,-1.27) 4(-2.54,1.27) 5(0,-1.27) 6(0,1.27) 7(2.54,-1.27) 8(2.54,1.27) 9(5.08,-1.27) 10(5.08,1.27)
PDIP-14_L19.7-W6.6-P2.54-LS8.3-BL
  rect 1.5x2 hole 1: 1(-7.62,-4)
  oval 1.5x2 hole 1: 2(-5.08,-4) 3(-2.54,-4) 4(0,-4) 5(2.54,-4) 6(5.08,-4) 7(7.62,-4) 8(7.62,4) 9(5.08,4) 10(2.54,4) 11(0,4) 12(-2.54,4) 13(-5.08,4) 14(-7.62,4)
Resistor_Small
  round 1.524 hole 1: 1(-3.88,0) 2(3.882,0)
TO-92-3_L4.5-W3.5-P1.27-L
  rect 1x1.2 hole 0.7x0.85: 1(-1.27,0)
  oval 1x1.2 hole 0.7x0.85: 2(0,0) 3(1.27,0)

## Nets
GND: 100.1 100#2.1 100#3.1 100#4.1 100#5.1 100#6.1 100#7.1 100#8.1 100NF.2 100NF#2.1 100NF#3.2 100NF#4.1 100NF#5.2 100NF#6.2 100NF#7.2 100NF#8.1 100NF#9.1 100NF#10.2 100UF.2 100UF#2.1 H1.4 H1.5 H1.6 H1.7 RED LINE.3 RED LINE.4 RED LINE.5 RED LINE.6 RED LINE.7 RED LINE.8 TL072.3 TL072.5 TL074.3 TL074.5 TL074.10 TL074.12 TL074#2.3 TL074#2.5 TL074#2.10 TL074#2.12
+12: 100NF#2.2 100NF#4.2 100NF#5.1 100NF#7.1 100NF#10.1 100UF.1 H1#2.5 H1#2.6 H1#2.7 LM13700.11 LM13700#2.11 RED LINE.9 RED LINE.10 TL072.8 TL074.4 TL074#2.4
-12: 100NF.1 100NF#3.1 100NF#6.1 100NF#8.2 100NF#9.2 100UF#2.2 LM13700.6 LM13700#2.6 RED LINE.1 RED LINE.2 TL072.4 TL074.11 TL074#2.11
CH1-CV: 20K#6.1 H1#2.8
CH1-IN: 20K.2 H1#2.3
CH1-MIX: 100K#3.2 H1#2.2
CH1-OUT: 680.2 H1#2.1
CH2-CV: 20K#12.1 H2.10
CH2-IN: 20K#2.2 H2.6
CH2-MIX: 100K#2.2 H2.4
CH2-OUT: 680#2.1 H2.2
CH3-CV: 20K#10.1 H2.9
CH3-IN: 20K#3.1 H2.5
CH3-MIX: 100K.2 H2.3
CH3-OUT: 680#3.2 H2.1
CH4-CV: 20K#8.1 H1.8
CH4-IN: 20K#4.1 H1.2
CH4-MIX: 100K#7.2 680#4.1
CH4/MIX-OUT: 1K.2 H1.1
CHAN1-OFFSET: 20K#5.1 H1#2.4
CHAN2-OFFSET: 20K#11.1 H2.8
CHAN3-OFFSET: 20K#9.1 H2.7
CHAN4-OFFSET: 20K#7.1 H1.3
CV-1: 20K#5.2 20K#6.2 120PF.1 BC558.3 TL074.2
CV-2: 20K#11.2 20K#12.2 120PF#2.1 BC558#2.3 TL074.13
CV-3: 20K#9.2 20K#10.2 120PF#3.1 BC558#3.3 TL074#2.2
CV-4: 20K#7.2 20K#8.2 120PF#4.1 BC558#4.3 TL074#2.13
IN-RES-1: 20K.1 100#2.2 LM13700.4
IN-RES-2: 20K#2.1 100#4.2 LM13700.13
IN-RES-3: 20K#3.2 100#3.2 LM13700#2.4
IN-RES-4: 20K#4.2 100#5.2 LM13700#2.13
LMOUT-1: 47K.2 120PF#5.2 LM13700.5 TL074.6
LMOUT-2: 47K#2.2 120PF#6.2 LM13700.12 TL074.9
LMOUT-3: 47K#3.2 120PF#7.2 LM13700#2.5 TL074#2.6
LMOUT-4: 47K#4.2 120PF#8.2 LM13700#2.12 TL074#2.9
MIX: 100K.1 100K#2.1 100K#3.1 100K#4.1 100K#7.1 TL072.2
MIX-1: 100K#4.2 100K#5.1 TL072.1
MIX-2: 1K.1 100K#6.1 TL072.7
MIXX: 100K#5.2 100K#6.2 TL072.6
OUT-1.1: 20K#13.2 120PF.2 TL074.1
OUT-1.2: 47K.1 120PF#5.1 680.1 TL074.7
OUT-2.1: 20K#14.2 120PF#2.2 TL074.14
OUT-2.2: 47K#2.1 120PF#6.1 680#2.2 TL074.8
OUT-3.1: 20K#15.2 120PF#3.2 TL074#2.1
OUT-3.2: 47K#3.1 120PF#7.1 680#3.1 TL074#2.7
OUT-4.1: 20K#16.2 120PF#4.2 TL074#2.14
OUT-4.2: 47K#4.1 120PF#8.1 680#4.2 TL074#2.8
PNP-1.1: BC558.1 LM13700.1
PNP-1.2: 20K#13.1 BC558.2
PNP-2.1: BC558#2.1 LM13700.16
PNP-2.2: 20K#14.1 BC558#2.2
PNP-3.1: BC558#3.1 LM13700#2.1
PNP-3.2: 20K#15.1 BC558#3.2
PNP-4.1: BC558#4.1 LM13700#2.16
PNP-4.2: 20K#16.1 BC558#4.2
RES-GND-1: 100#6.2 LM13700.3
RES-GND-2: 100.2 LM13700.14
RES-GND-3: 100#7.2 LM13700#2.3
RES-GND-4: 100#8.2 LM13700#2.14

Pads without a net: LM13700 2 7 8 9 10 15; LM13700#2 2 7 8 9 10 15

## Via types
v1: diameter 0.61, hole 0.305, Top Layer to Bottom Layer, 124 vias

## Routing (per net, layer and track width the routed paths; a pad name or vN(x,y) marks a point on that pad's centre or on a via; arc(x,y) is an arc through that point)
+12: length 208.4
  Top Layer w0.254: v1(36.89,79.62) v1(36.89,90.39) 100NF#4.2 ; RED LINE.10 RED LINE.9 ; 100NF#7.1 43.53,29.1 v1(43.53,19.48) v1(43.53,16.37) v1(43.53,11.2) ; v1(11.68,95.56) 100NF#2.2 v1(11.68,90.39) v1(11.68,79.62) 11.56,79.49 11.56,56.43 H1#2.7 H1#2.6 H1#2.5 11.56,49.1 11.56,39.04 100NF#10.1 v1(14.1,19.48) v1(14.1,8.81) ; TL072.8 v1(38.77,11.2)
  Bottom Layer w0.254: 100UF.1 19.05,96.83 RED LINE.10 ; TL074#2.4 36.83,79.68 v1(36.89,79.62) ; v1(11.68,90.39) v1(36.89,90.39) ; TL074.4 11.62,79.68 v1(11.68,79.62) ; v1(43.53,19.48) LM13700#2.11 ; v1(11.68,95.56) RED LINE.9 ; v1(43.53,16.37) 100NF#5.1 ; v1(43.53,11.2) v1(38.77,11.2) ; v1(14.1,19.48) LM13700.11 ; TL072.8 38.26,8.81 v1(14.1,8.81)
-12: length 214.2
  Top Layer w0.254: v1(13.84,79.68) v1(13.84,89.19) 100NF#3.1 ; v1(30.86,19.48) 30.86,16.43 ; v1(6.09,19.48) v1(6.09,30.24) ; RED LINE.2 RED LINE.1 ; v1(39.05,95.56) 100NF.1 v1(39.05,89.19) v1(39.05,79.68) 39.37,79.36 v1(39.37,19.48) v1(39.37,12.43) ; v1(45.09,1.7) v1(45.09,12.43)
  Bottom Layer w0.254: v1(39.37,12.43) v1(45.09,12.43) 100NF#6.1 ; v1(39.05,79.68) TL074#2.11 ; v1(45.09,1.7) TL072.4 ; v1(30.86,19.48) LM13700#2.6 v1(39.37,19.48) ; v1(6.09,30.24) 100NF#9.2 ; 100UF#2.2 31.75,96.83 RED LINE.2 ; v1(6.09,19.48) LM13700.6 10.03,18.21 29.08,18.21 30.86,16.43 ; v1(13.84,79.68) TL074.11 ; RED LINE.1 v1(39.05,95.56) ; v1(39.05,89.19) v1(13.84,89.19)
CH1-CV: length 21.2
  Top Layer w0.254: v1(3.04,47.69) v1(3.04,57.85)
  Bottom Layer w0.254: v1(3.04,57.85) H1#2.8 ; v1(3.04,47.69) 20K#6.1
CH1-IN: length 10.2
  Top Layer w0.254: 20K.2 v1(10.87,45.15)
  Bottom Layer w0.254: v1(10.87,45.15) H1#2.3
CH1-MIX: length 43.2
  Top Layer w0.254: v1(1.91,16.59) 100K#3.2 ; v1(6.86,42.61) 6.86,16.97 v1(6.48,16.59)
  Bottom Layer w0.254: v1(6.86,42.61) H1#2.2 ; v1(1.91,16.59) v1(6.48,16.59)
CH1-OUT: length 32
  Top Layer w0.254: v1(14.11,40.07) v1(14.11,68.12)
  Bottom Layer w0.254: v1(14.11,68.12) 680.2 ; H1#2.1 v1(14.11,40.07)
CH2-CV: length 22.3
  Top Layer w0.254: v1(16.87,60.39) v1(16.87,47.89)
  Bottom Layer w0.254: 20K#12.1 v1(16.87,47.89) ; v1(16.87,60.39) H2.10
CH2-IN: length 20
  Top Layer w0.254: v1(27.52,34.07) v1(27.52,50.23)
  Bottom Layer w0.254: v1(27.52,34.07) 20K#2.2 ; v1(27.52,50.23) H2.6
CH2-MIX: length 55.7
  Top Layer w0.254: 100K#2.2 v1(4.69,13.12) ; v1(19.62,13.12) v1(19.62,37.14) ; v1(22.08,37.14) v1(22.08,45.15)
  Bottom Layer w0.254: v1(19.62,37.14) v1(22.08,37.14) ; v1(19.62,13.12) v1(4.69,13.12) ; v1(22.08,45.15) H2.4
CH2-OUT: length 41
  Top Layer w0.254: v1(8.82,41.36) 680#2.1
  Bottom Layer w0.254: v1(8.82,41.36) 14.7,41.36 15.99,40.07 H2.2
CH3-CV: length 17.1
  Top Layer w0.254: v1(31.03,57.85) v1(31.03,47.86)
  Bottom Layer w0.254: v1(31.03,47.86) 20K#10.1 ; v1(31.03,57.85) H2.9
CH3-IN: length 20.2
  Top Layer w0.254: v1(22.97,31.29) v1(22.97,47.69)
  Bottom Layer w0.254: v1(22.97,47.69) H2.5 ; 20K#3.1 v1(22.97,31.29)
CH3-MIX: length 50.4
  Top Layer w0.254: v1(7.49,12.07) 100K.2 ; v1(20.87,38.16) v1(20.87,42.61) ; v1(18.5,12.07) v1(18.5,38.16)
  Bottom Layer w0.254: v1(18.5,38.16) v1(20.87,38.16) ; v1(20.87,42.61) H2.3 ; v1(18.5,12.07) v1(7.49,12.07)
CH3-OUT: length 43.9
  Top Layer w0.254: v1(41.86,38.19) 680#3.2
  Bottom Layer w0.254: v1(41.86,38.19) 26,38.19 H2.1
CH4-CV: length 18.3
  Top Layer w0.254: v1(44.92,57.85) v1(44.92,47.86)
  Bottom Layer w0.254: H1.8 v1(44.92,57.85) ; v1(44.92,47.86) 20K#8.1
CH4-IN: length 9.1
  Top Layer w0.254: v1(41.21,42.61) 20K#4.1
  Bottom Layer w0.254: H1.2 v1(41.21,42.61)
CH4-MIX: length 82.2
  Top Layer w0.254: v1(10.03,33.83) 10.03,10.35 10.27,10.11 ; v1(17.65,41.33) v1(17.65,33.83) ; v1(28.46,41.32) v1(28.46,68.12)
  Bottom Layer w0.254: v1(17.65,33.83) v1(10.03,33.83) ; v1(28.46,68.12) 680#4.1 ; v1(17.65,41.33) 28.45,41.33 v1(28.46,41.32)
CH4/MIX-OUT: length 46.9
  Top Layer w0.254: v1(34.09,10.08) v1(34.09,12.41) ; v1(38.01,12.41) H1.1
  Bottom Layer w0.254: v1(34.09,10.08) 1K.2 ; v1(34.09,12.41) v1(38.01,12.41)
CHAN1-OFFSET: length 9.3
  Bottom Layer w0.254: H1#2.4 11.4,46.41 5.74,46.41 20K#5.1
CHAN2-OFFSET: length 14.5
  Top Layer w0.254: v1(23.2,49.5) v1(23.2,55.31) ; v1(18.29,49.5) 20K#11.1
  Bottom Layer w0.254: v1(23.2,55.31) H2.8 ; v1(18.29,49.5) v1(23.2,49.5)
CHAN3-OFFSET: length 14.8
  Top Layer w0.254: 20K#9.1 v1(35.21,52.77)
  Bottom Layer w0.254: v1(35.21,52.77) H2.7
CHAN4-OFFSET: length 13.6
  Top Layer w0.254: v1(49.15,45.64) 20K#7.1
  Bottom Layer w0.254: v1(49.15,45.64) 38.51,45.64 H1.3
CV-1: length 51.6
  Top Layer w0.254: v1(5.78,42.85) v1(5.78,55.45) 5.78,55.88 6.48,56.58 6.48,83.62 120PF.1
  Bottom Layer w0.254: 120PF.1 TL074.2 ; 20K#6.2 20K#5.2 v1(5.78,55.45) ; BC558.3 v1(5.78,42.85)
CV-2: length 50.9
  Top Layer w0.254: v1(19.64,42.85) v1(19.64,55.65) ; v1(18.29,84.76) 20K#11.2
  Bottom Layer w0.254: BC558#2.3 v1(19.64,42.85) ; 120PF#2.1 v1(18.29,84.76) TL074.13 ; 20K#12.2 20K#11.2 v1(19.64,55.65)
CV-3: length 50.8
  Top Layer w0.254: v1(36.41,55.62) 36.41,42.89 v1(36.45,42.85) ; v1(32.38,84.76) 32.38,55.65 20K#10.2
  Bottom Layer w0.254: 20K#10.2 20K#9.2 v1(36.41,55.62) ; 120PF#3.1 v1(32.38,84.76) 34.03,84.76 ; v1(36.45,42.85) BC558#3.3
CV-4: length 51.4
  Top Layer w0.254: BC558#4.3 50.29,44.12 50.29,54.48 20K#7.2 ; v1(47.69,84.76) v1(47.69,55.62)
  Bottom Layer w0.254: 20K#8.2 v1(47.69,55.62) 20K#7.2 ; TL074#2.13 120PF#4.1 v1(47.69,84.76)
IN-RES-1: length 20.5
  Top Layer w0.254: 100#2.2 v1(1.78,24.56) ; v1(3.11,27.1) 20K.1
  Bottom Layer w0.254: LM13700.4 v1(1.78,24.56) ; 100#2.2 v1(3.11,27.1)
IN-RES-2: length 19.5
  Top Layer w0.254: v1(23.9,34.07) 100#4.2 v1(23.9,24.56)
  Bottom Layer w0.254: v1(23.9,24.56) LM13700.13 ; 20K#2.1 v1(23.9,34.07)
IN-RES-3: length 16.5
  Top Layer w0.254: v1(26.8,31.29) 100#3.2 v1(26.8,24.56)
  Bottom Layer w0.254: v1(26.8,31.29) 20K#3.2 ; LM13700#2.4 v1(26.8,24.56)
IN-RES-4: length 19.4
  Top Layer w0.254: 20K#4.2 100#5.2 v1(48.97,24.56)
  Bottom Layer w0.254: v1(48.97,24.56) LM13700#2.13
LMOUT-1: length 80.2
  Top Layer w0.254: v1(0.64,39.55) 0.64,22.07 v1(0.68,22.02) ; TL074.6 10.16,73.14 v1(10.16,39.55) ; v1(1.9,74.6) 47K.2
  Bottom Layer w0.254: v1(0.64,39.55) v1(10.16,39.55) ; v1(1.9,74.6) 120PF#5.2 TL074.6 ; LM13700.5 v1(0.68,22.02)
LMOUT-2: length 74.4
  Top Layer w0.254: v1(24.04,35.27) 24.04,63.39 v1(24,63.42) ; v1(25.37,35.27) 25.37,22.03 v1(25.4,22.01) ; v1(23.53,74.6) 47K#2.2 ; v1(21.93,63.42) v1(21.93,74.6)
  Bottom Layer w0.254: v1(21.93,63.42) v1(24,63.42) ; TL074.9 120PF#6.2 v1(21.93,74.6) v1(23.53,74.6) ; v1(24.04,35.27) v1(25.37,35.27) ; v1(25.4,22.01) 16.4,22.01 LM13700.12
LMOUT-3: length 66
  Top Layer w0.254: LM13700#2.5 31.12,25 31.12,44.63 33.78,47.3 33.78,62.66 35.94,64.82 35.94,72.69 TL074#2.6 ; v1(27.19,74.6) 47K#3.2
  Bottom Layer w0.254: TL074#2.6 120PF#7.2 v1(27.19,74.6)
LMOUT-4: length 63.4
  Top Layer w0.254: v1(48.91,74.6) 47K#4.2 ; LM13700#2.12 40.13,23.6 40.13,72.7 TL074#2.9
  Bottom Layer w0.254: TL074#2.9 120PF#8.2 v1(48.91,74.6)
MIX: length 43
  Top Layer w0.254: v1(12.94,3.78) 12.96,3.77 100K#4.1 ; 41.31,1.7 v1(41.31,3.78)
  Bottom Layer w0.254: 100K#4.1 12.94,2.35 100K#7.1 10.22,2.3 100K.1 100K#2.1 4.64,2.24 100K#3.1 ; v1(12.94,3.78) v1(41.31,3.78)
MIX-1: length 35.4
  Top Layer w0.254: v1(15.71,6.45) 100K#5.1 v1(15.71,0.87) ; v1(12.96,6.45) 12.96,10.13
  Bottom Layer w0.254: v1(15.71,0.87) 37.94,0.87 TL072.1 ; v1(12.96,6.45) v1(15.71,6.45)
MIX-2: length 29.9
  Top Layer w0.254: v1(21.13,7.12) 1K.1 ; v1(41.31,7.12) 41.31,9.32
  Bottom Layer w0.254: 100K#6.1 1K.1 ; v1(41.31,7.12) v1(21.13,7.12)
MIXX: length 32
  Top Layer w0.254: v1(18.41,7.8) 100K#6.2 ; TL072.6 v1(43.85,7.82)
  Bottom Layer w0.254: v1(18.41,7.8) 43.83,7.8 v1(43.85,7.82) ; 15.71,10.13 18.37,10.13 100K#6.2
OUT-1.1: length 35.2
  Top Layer w0.254: 20K#13.2 v1(7.19,87.3)
  Bottom Layer w0.254: 120PF.2 v1(7.19,87.3) TL074.1
OUT-1.2: length 13.4
  Top Layer w0.254: TL074.7 8.82,71.94 680.1 ; 47K.1 v1(1.9,72.06)
  Bottom Layer w0.254: v1(1.9,72.06) 120PF#5.1 TL074.7
OUT-2.1: length 35.4
  Top Layer w0.254: 20K#14.2 21.06,86.31 120PF#2.2
  Bottom Layer w0.254: 120PF#2.2 TL074.14
OUT-2.2: length 20.5
  Top Layer w0.254: v1(23.53,72.06) v1(23.53,65.33)
  Bottom Layer w0.254: v1(23.53,72.06) 120PF#6.1 TL074.8 ; v1(23.53,65.33) 680#2.2
OUT-3.1: length 35.9
  Top Layer w0.254: 120PF#3.2 29.21,85.9 29.21,56.04 20K#15.2
  Bottom Layer w0.254: 120PF#3.2 TL074#2.1
OUT-3.2: length 20.5
  Top Layer w0.254: v1(27.19,72.06) v1(27.19,65.33)
  Bottom Layer w0.254: TL074#2.7 120PF#7.1 v1(27.19,72.06) ; v1(27.19,65.33) 680#3.1
OUT-4.1: length 35.2
  Top Layer w0.254: v1(43.6,87.3) 20K#16.2
  Bottom Layer w0.254: 120PF#4.2 v1(43.6,87.3) TL074#2.14
OUT-4.2: length 13.6
  Top Layer w0.254: 680#4.2 42.03,68.3 TL074#2.8 ; v1(48.91,72.06) 48.91,69.36
  Bottom Layer w0.254: TL074#2.8 120PF#8.1 v1(48.91,72.06)
PNP-1.1: length 17.7
  Top Layer w0.254: v1(1.78,32.18) BC558.1
  Bottom Layer w0.254: v1(1.78,32.18) LM13700.1
PNP-1.2: length 9
  Top Layer w0.254: v1(3.04,44.88) 3.05,44.87 BC558.2 ; v1(7.19,44.88) 20K#13.1
  Bottom Layer w0.254: v1(3.04,44.88) v1(7.19,44.88)
PNP-2.1: length 11
  Top Layer w0.254: BC558#2.1 15.62,32.94 LM13700.16
PNP-2.2: length 9.2
  Top Layer w0.254: BC558#2.2 16.89,44.87 v1(16.88,44.88) ; v1(21.06,44.88) 20K#14.1
  Bottom Layer w0.254: v1(21.06,44.88) v1(16.88,44.88)
PNP-3.1: length 11.3
  Top Layer w0.254: LM13700#2.1 32.51,33.76 BC558#3.1
PNP-3.2: length 9.2
  Top Layer w0.254: v1(29.62,44.88) 20K#15.1 ; v1(33.78,44.88) BC558#3.2
  Bottom Layer w0.254: v1(29.62,44.88) v1(33.78,44.88)
PNP-4.1: length 15.4
  Top Layer w0.254: v1(46.48,32.18) BC558#4.1
  Bottom Layer w0.254: LM13700#2.16 v1(46.48,32.18)
PNP-4.2: length 9.2
  Top Layer w0.254: v1(47.75,44.88) BC558#4.2 ; 20K#16.1 v1(43.6,44.88)
  Bottom Layer w0.254: v1(47.75,44.88) v1(43.6,44.88)
RES-GND-1: length 4.2
  Bottom Layer w0.254: LM13700.3 100#6.2
RES-GND-2: length 4.8
  Bottom Layer w0.254: 100.2 LM13700.14
RES-GND-3: length 4.6
  Bottom Layer w0.254: 100#7.2 LM13700#2.3
RES-GND-4: length 4.5
  Bottom Layer w0.254: 100#8.2 LM13700#2.14

## Copper pours and planes (outline as drawn; the poured copper is in the pictures)
GND on Top Layer: 0,100 50.8,100 50.8,0 0,0
GND on Bottom Layer: 0,100 50.8,100 50.8,0 0,0

## Text on the board
Bottom Silkscreen Layer: JLCJLCJLCJLC | 304 Quad Channel Voltage Controlled Mixer / v0.1 Main Board / F113X 2025
